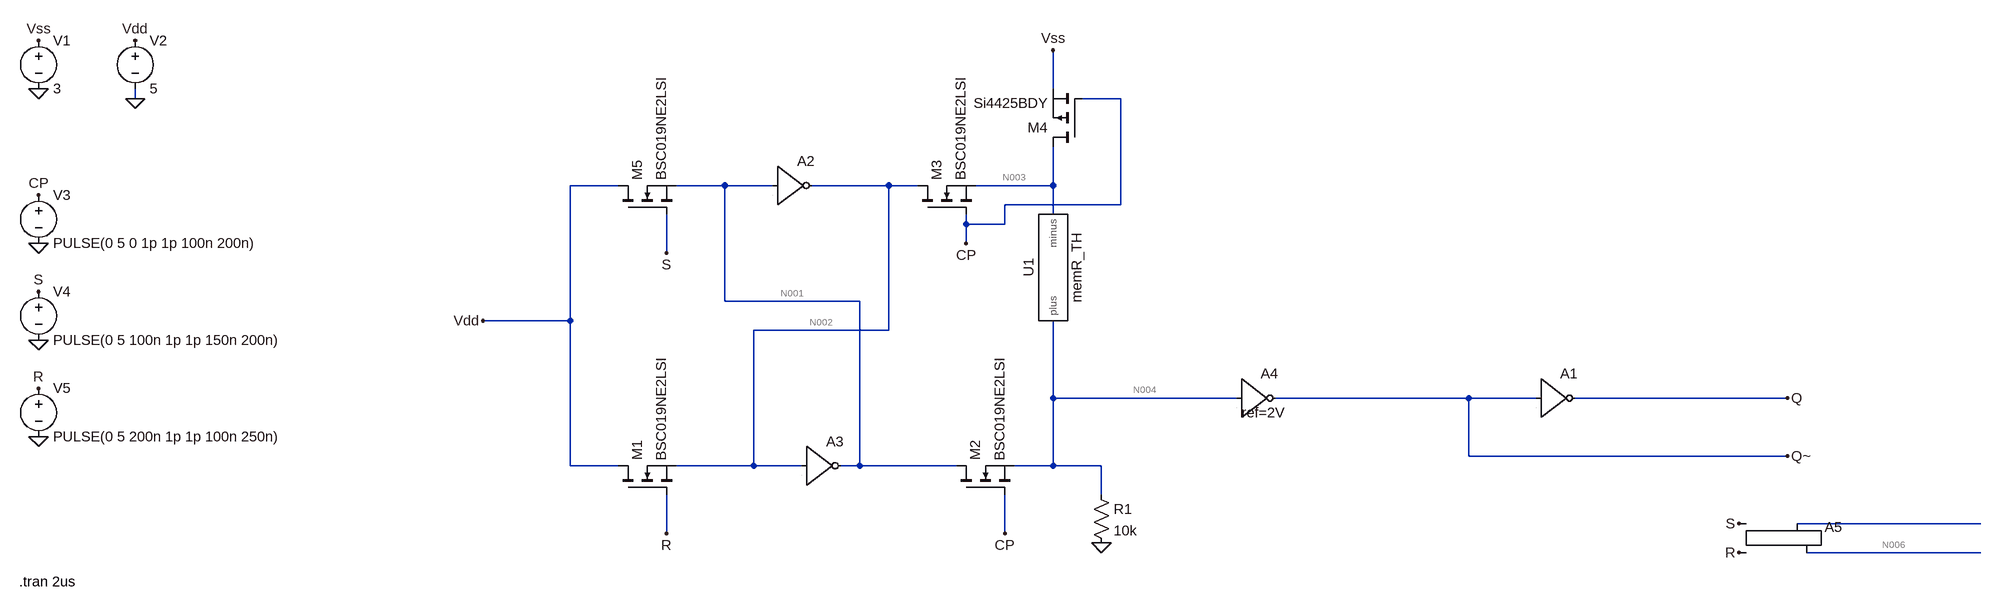
[diagram p0: schematic SR触发器.asc]
SR触发器.asc, the LTspice schematic file:
Version 4
SHEET 1 1924 1088
WIRE 384 -112 384 -176
WIRE -1136 -96 -1136 -112
WIRE 496 -96 432 -96
WIRE -336 48 -416 48
WIRE -160 48 -240 48
WIRE -80 48 -160 48
WIRE 112 48 -16 48
WIRE 160 48 112 48
WIRE 384 48 384 -16
WIRE 384 48 256 48
WIRE 496 80 496 -96
WIRE 496 80 304 80
WIRE 384 96 384 48
WIRE 240 112 240 96
WIRE 304 112 304 80
WIRE 304 112 240 112
WIRE 240 144 240 112
WIRE -256 160 -256 96
WIRE -160 240 -160 48
WIRE 64 240 -160 240
WIRE -416 272 -416 48
WIRE -416 272 -560 272
WIRE 112 288 112 48
WIRE 112 288 -112 288
WIRE 384 400 384 272
WIRE 688 400 384 400
WIRE 1072 400 752 400
WIRE 1184 400 1072 400
WIRE 1600 400 1248 400
WIRE 1072 496 1072 400
WIRE 1600 496 1072 496
WIRE -416 512 -416 272
WIRE -336 512 -416 512
WIRE -112 512 -112 288
WIRE -112 512 -240 512
WIRE -32 512 -112 512
WIRE 64 512 64 240
WIRE 64 512 32 512
WIRE 224 512 64 512
WIRE 384 512 384 400
WIRE 384 512 320 512
WIRE 464 512 384 512
WIRE 464 560 464 512
WIRE 1920 608 1616 608
WIRE -256 624 -256 560
WIRE 304 624 304 560
WIRE 1920 656 1632 656
FLAG 1600 400 Q
FLAG 1600 496 Q~
FLAG -256 624 R
FLAG -256 160 S
FLAG 240 144 CP
FLAG 304 624 CP
FLAG -560 272 Vdd
FLAG 384 -176 Vss
FLAG -1296 -112 0
FLAG -1136 -96 0
FLAG -1296 144 0
FLAG -1296 304 0
FLAG -1296 464 0
FLAG -1296 -192 Vss
FLAG -1136 -192 Vdd
FLAG -1296 64 CP
FLAG -1296 224 S
FLAG -1296 384 R
FLAG 464 640 0
FLAG 1520 656 R
FLAG 1520 608 S
SYMBOL memR_TH 384 192 R270
SYMATTR InstName U1
SYMBOL voltage -1296 -208 R0
WINDOW 123 0 0 Left 0
WINDOW 39 0 0 Left 0
SYMATTR InstName V1
SYMATTR Value 3
SYMBOL voltage -1136 -208 R0
WINDOW 123 0 0 Left 0
WINDOW 39 0 0 Left 0
SYMATTR InstName V2
SYMATTR Value 5
SYMBOL voltage -1296 48 R0
WINDOW 123 0 0 Left 0
WINDOW 39 0 0 Left 0
SYMATTR InstName V3
SYMATTR Value PULSE(0 5 0 1p 1p 100n 200n)
SYMBOL voltage -1296 208 R0
WINDOW 123 0 0 Left 0
WINDOW 39 0 0 Left 0
SYMATTR InstName V4
SYMATTR Value PULSE(0 5 100n 1p 1p 150n 200n)
SYMBOL voltage -1296 368 R0
WINDOW 123 0 0 Left 0
WINDOW 39 0 0 Left 0
SYMATTR InstName V5
SYMATTR Value PULSE(0 5 200n 1p 1p 100n 250n)
SYMBOL res 448 544 R0
SYMATTR InstName R1
SYMATTR Value 10k
SYMBOL pmos 432 -16 R180
SYMATTR InstName M4
SYMATTR Value Si4425BDY
SYMBOL Digital\\inv 688 336 R0
WINDOW 3 -5 114 Invisible 2
WINDOW 123 8 60 Left 2
WINDOW 39 8 88 Left 2
SYMATTR Value Vhigh=4V Vlow=0V
SYMATTR SpiceLine ref=2V
SYMATTR InstName A4
SYMBOL Digital\\inv 1184 336 R0
WINDOW 3 -5 114 Invisible 2
SYMATTR Value Vhigh=4V Vlow=0V
SYMATTR InstName A1
SYMBOL Digital\\inv -80 -16 R0
WINDOW 3 -5 114 Invisible 2
WINDOW 123 8 60 Left 2
SYMATTR Value Vhigh=4V Vlow=0V
SYMATTR InstName A2
SYMBOL Digital\\inv -32 448 R0
WINDOW 3 -5 114 Invisible 2
WINDOW 123 8 60 Left 2
SYMATTR Value Vhigh=4V Vlow=0V
SYMATTR InstName A3
SYMBOL nmos -336 96 R270
SYMATTR InstName M5
SYMATTR Value BSC019NE2LSI
SYMBOL nmos -336 560 R270
SYMATTR InstName M1
SYMATTR Value BSC019NE2LSI
SYMBOL nmos 224 560 R270
SYMATTR InstName M2
SYMATTR Value BSC019NE2LSI
SYMBOL nmos 160 96 R270
SYMATTR InstName M3
SYMATTR Value BSC019NE2LSI
SYMBOL Digital\\srflop 1568 560 R0
SYMATTR InstName A5
TEXT -1328 704 Left 2 !.tran 2us

The netlist it stands for:
* SR触发器.asc
XU1 N004 N003 memR_TH  ; pins plus minus
V1 Vss 0 3
V2 Vdd 0 5
V3 CP 0 PULSE(0 5 0 1p 1p 100n 200n)
V4 S 0 PULSE(0 5 100n 1p 1p 150n 200n)
V5 R 0 PULSE(0 5 200n 1p 1p 100n 250n)
R1 N004 0 10k
M4 N003 CP Vss Vss Si4425BDY
A4 N004 0 0 0 0 Q~ 0 0 BUF Vhigh=4V Vlow=0V ref=2V
A1 Q~ 0 0 0 0 Q 0 0 BUF Vhigh=4V Vlow=0V
A2 N001 0 0 0 0 N002 0 0 BUF Vhigh=4V Vlow=0V
A3 N002 0 0 0 0 N001 0 0 BUF Vhigh=4V Vlow=0V
M5 Vdd S N001 N001 BSC019NE2LSI
M1 Vdd R N002 N002 BSC019NE2LSI
M2 N001 CP N004 N004 BSC019NE2LSI
M3 N002 CP N003 N003 BSC019NE2LSI
A5 S R 0 0 0 N006 N005 0 SRFLOP
.model NMOS NMOS
.model PMOS PMOS
.lib standard.mos
.tran 2us
.lib C:\Users\yv236\Documents\LTspice\memR_TH.sub
.backanno
.end

* Results of the author's LTspice run, read from the files saved beside the schematic
* Operating Point, zero values left out:
*   V(n004) = 282.3 mV
*   V(n003) = 3 V
*   V(vss) = 3 V
*   V(vdd) = 5 V
*   V(q~) = 4 V
*   V(n001) = 515.3 µV
*   V(n002) = 4 V
*   V(n006) = 1 V
*   Id(M4) = -543.5 µA
*   Is(M4) = 543.5 µA
*   Id(M5) = 30.71 nA
*   Is(M5) = -30.71 nA
*   Id(M1) = 30.7 nA
*   Is(M1) = -30.7 nA
*   Id(M2) = -515.3 µA
*   Is(M2) = 515.3 µA
*   Id(M3) = 30.7 nA
*   Is(M3) = -30.7 nA
*   I(R1) = 28.23 µA
*   I(V1) = -543.5 µA
*   I(V2) = -61.41 nA
*   I8(A3) = -515.3 µA
*   I6(A3) = 515.3 µA
*   Ix(u1:PLUS) = -543.5 µA
*   Ix(u1:MINUS) = 543.5 µA
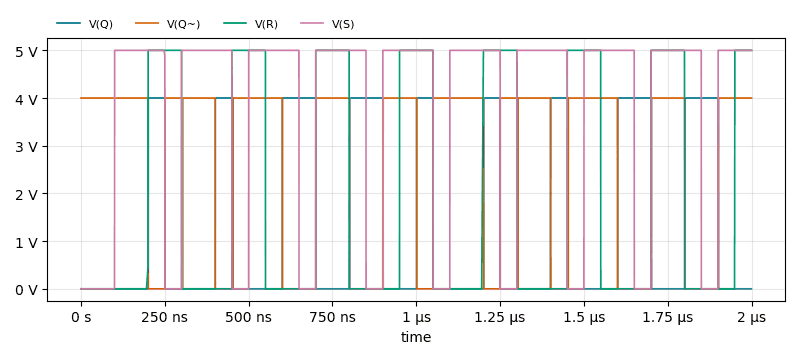
[diagram p1: Transient Analysis of SR触发器.asc, plotted from the saved traces]
* Transient Analysis, 1 run:
*   V(Q): min 0 V, max 4 V, average 1.314 V, rms 2.292 V, last 0 V
*   V(Q~): min 0 V, max 4 V, average 2.686 V, rms 3.278 V, last 4 V
*   V(R): min 0 V, max 5 V, average 1.875 V, rms 3.062 V, last 5 V
*   V(S): min 0 V, max 5 V, average 3.625 V, rms 4.257 V, last 5 V